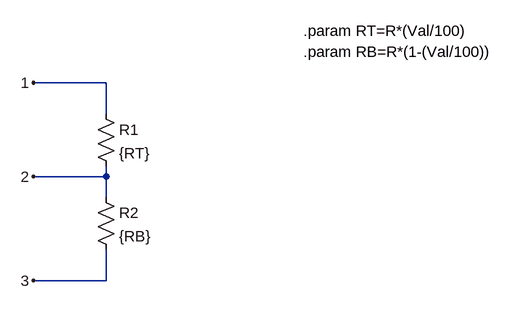
[diagram p0: schematic mypot.asc]
mypot.asc, the LTspice schematic file:
Version 4
SHEET 1 880 680
WIRE 240 16 128 16
WIRE 240 64 240 16
WIRE 240 160 240 144
WIRE 240 160 128 160
WIRE 240 192 240 160
WIRE 240 320 240 272
WIRE 240 320 128 320
FLAG 128 16 1
FLAG 128 160 2
FLAG 128 320 3
SYMBOL res 224 48 R0
SYMATTR InstName R1
SYMATTR Value {RT}
SYMBOL res 224 176 R0
SYMATTR InstName R2
SYMATTR Value {RB}
TEXT 544 -64 Left 2 !.param RT=R*(Val/100)
TEXT 544 -32 Left 2 !.param RB=R*(1-(Val/100))

The netlist it stands for:
* mypot.asc
R1 1 2 {RT}
R2 2 3 {RB}
.param RT=R*(Val/100)
.param RB=R*(1-(Val/100))
.backanno
.end